# Altium schematic sheet Transmitter.SchDoc: Transmitter
size A4; Organization: HCM Univercity Technology; Address1: 268 Li Thuong Kiet Street; Address2: District 10; Address3: Ho Chi Minh City; Address4: Viet Nam; DocumentNumber: 1.0; Revision: v1.1; SheetNumber: 1; SheetTotal: 1
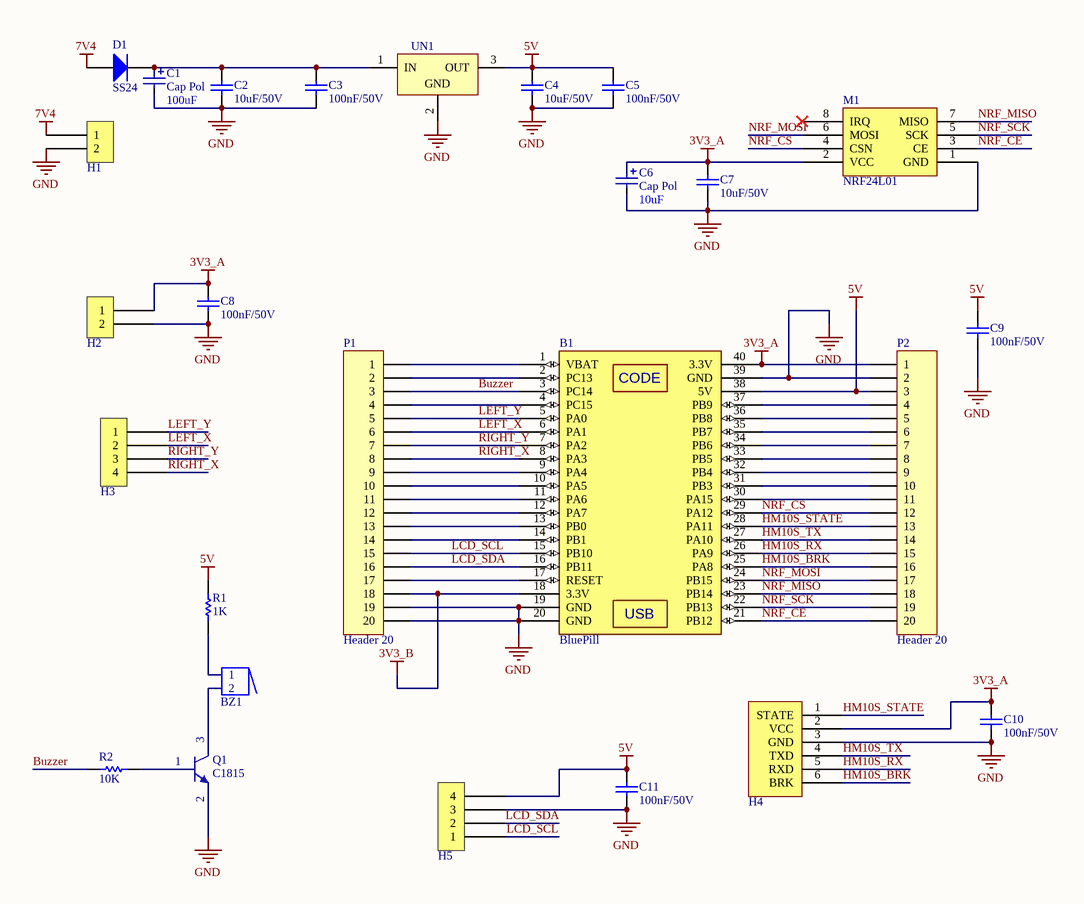
[diagram p0: Transmitter.SchDoc]

## Parts
B1  BluePill  [BlUEPILL]
BZ1  Buzzer  [BUZZER]  (value not drawn)
C1  Cap Pol  value 100uF  [CP1/2]
C2  value 10uF/50V  [CAP-SM-0805]  (hidden comment: Cap-10uF-50V-0805)
C3  value 100nF/50V  [CAP-SM-0805]  (hidden comment: Cap-100nF-50V-0805)
C4  value 10uF/50V  [CAP-SM-0805]  (hidden comment: Cap-10uF-50V-0805)
C5  value 100nF/50V  [CAP-SM-0805]  (hidden comment: Cap-100nF-50V-0805)
C6  Cap Pol  value 10uF  [CP1/2]
C7  value 10uF/50V  [CAP-SM-0805]  (hidden comment: Cap-10uF-50V-0805)
C8  value 100nF/50V  [CAP-SM-0805]  (hidden comment: Cap-100nF-50V-0805)
C9  value 100nF/50V  [CAP-SM-0805]  (hidden comment: Cap-100nF-50V-0805)
C10  value 100nF/50V  [CAP-SM-0805]  (hidden comment: Cap-100nF-50V-0805)
C11  value 100nF/50V  [CAP-SM-0805]  (hidden comment: Cap-100nF-50V-0805)
D1  SS24  [SS24]
H1  XH B2B  [XH B2B]  (value not drawn)
H2  XH B2B  [XH B2B]  (value not drawn)
H3  XHB4B  [XHB4B]  (value not drawn)
H4  HC-05-06-TH  [HM-10S CC2541]  (value not drawn)
H5  XHB4B  [XHB4B]  (value not drawn)
M1  NRF24L01  [NRF24L01]
P1  Header 20  [HDR1X20]
P2  Header 20  [HDR1X20]
Q1  C1815  [QTO-92]
R1  value 1K  [RES-SM-0805]  (hidden comment: Res-1K-0805)
R2  value 10K  [RES-SM-0805]  (hidden comment: Res-10k-0805)
UN1  LM7805  [QTO-220]  (value not drawn)

## Nets
3V3_A: B1.40(3.3V) C6.1 C7.2 C8.2 C10.1 H2.1 H4.2(VCC) M1.2(VCC) P2.1
3V3_B: B1.18(3.3V) P1.18
5V: B1.38(5V) C4.2 C5.2 C9.1 C11.2 H5.4 P2.3 R1.2 UN1.3(OUT)
7V4: D1.2(A) H1.1
GND: B1.19(GND) B1.20(GND) B1.39(GND) C1.2 C2.1 C3.1 C4.1 C5.1 C6.2 C7.1 C8.1 C9.2 C10.2 C11.1 H1.2 H2.2 H4.3(GND) H5.3 M1.1(GND) P1.19 P1.20 P2.2 Q1.2(E) UN1.2(GND)
Buzzer: B1.3(PC14) P1.3 R2.1
HM10S_BRK: B1.25(PA8) H4.6(BRK) P2.16
HM10S_RX: B1.26(PA9) H4.5(RXD) P2.15
HM10S_STATE: B1.28(PA11) H4.1(STATE) P2.13
HM10S_TX: B1.27(PA10) H4.4(TXD) P2.14
LCD_SCL: B1.15(PB10) H5.1 P1.15
LCD_SDA: B1.16(PB11) H5.2 P1.16
LEFT_X: B1.6(PA1) H3.2 P1.6
LEFT_Y: B1.5(PA0) H3.1 P1.5
NRF_CE: B1.21(PB12) M1.3(CE) P2.20
NRF_CS: B1.29(PA12) M1.4(CSN) P2.12
NRF_MISO: B1.23(PB14) M1.7(MISO) P2.18
NRF_MOSI: B1.24(PB15) M1.6(MOSI) P2.17
NRF_SCK: B1.22(PB13) M1.5(SCK) P2.19
RIGHT_X: B1.8(PA3) H3.4 P1.8
RIGHT_Y: B1.7(PA2) H3.3 P1.7
NetB1_1: B1.1(VBAT) P1.1
NetB1_2: B1.2(PC13) P1.2
NetB1_4: B1.4(PC15) P1.4
NetB1_9: B1.9(PA4) P1.9
NetB1_10: B1.10(PA5) P1.10
NetB1_11: B1.11(PA6) P1.11
NetB1_12: B1.12(PA7) P1.12
NetB1_13: B1.13(PB0) P1.13
NetB1_14: B1.14(PB1) P1.14
NetB1_17: B1.17(RESET) P1.17
NetB1_30: B1.30(PA15) P2.11
NetB1_31: B1.31(PB3) P2.10
NetB1_32: B1.32(PB4) P2.9
NetB1_33: B1.33(PB5) P2.8
NetB1_34: B1.34(PB6) P2.7
NetB1_35: B1.35(PB7) P2.6
NetB1_36: B1.36(PB8) P2.5
NetB1_37: B1.37(PB9) P2.4
NetBZ1_1: BZ1.1 R1.1
NetBZ1_2: BZ1.2 Q1.3(C)
NetC1_1: C1.1 C2.2 C3.2 D1.1(K) UN1.1(IN)
NetQ1_1: Q1.1(B) R2.2

Not connected (* = marked no-connect by the designer): M1 8(IRQ)*

## Notes on the sheet
- Title
- Size:
- Date:
- A4
- Number:
- Time:
- Revision:
- Sheet
- of
- File:
- (in symbol BluePill) CODE; USB

## Library data of the parts
C1 C6 = Cap-TH-Pol: Polarized Capacitor (Radial)
C2 C4 C7 = Cap-10uF-50V-0805: CAP CER 10UF 50V X5R 0805; Manufacturer: Yageo; Manufacturer Part Number: CC0805KKX5R9BB106; Local Supplier: thegioiic; Local Supplier Link: https://thegioiic.com/products/tu-10uf-50v-0805; Supplier 1: Digikey; Supplier 1 Link: https://www.digikey.com/product-detail/en/yageo/CC0805KKX5R9BB106/311-3499-2-ND/7164383; Supplier 1 Part Number: 311-3499-2-ND
C3 C5 C8-C11 = Cap-100nF-50V-0805: CAP CER 0.1UF 50V Y5V 0805; Manufacturer: Samsung Electro-Mechanics; Manufacturer Part Number: CL21F104ZBCNNNC; Local Supplier: thegioiic; Local Supplier Link: https://thegioiic.com/products/tu-100nf-0-1uf-50v-0805; Supplier 1: Digikey; Supplier 1 Part Number: 1276-1007-1-ND; Supplier 1 Link: https://www.digikey.com/product-detail/en/samsung-electro-mechanics/CL21F104ZBCNNNC/1276-1007-1-ND/3889093
D1 = Diode-SS24: DIODE SCHOTTKY 40V 2A DO214AA; Manufacturer: ON Semiconductor; Local Supplier: thegioiic; Local Supplier Link: https://thegioiic.com/products/ss24-smb; Supplier 1: Digikey; Supplier 1 Part Number: SS24FSCT-ND; Manufacturer Part Number: SS24; Supplier 1 Link: https://www.digikey.com/product-detail/en/on-semiconductor/SS24/SS24FSCT-ND/1626273
H3 H5 = XH B4B
H4 = HM-10S CC2541: Local Supplier: HShop; Local Supplier Link: https://hshop.vn/products/mach-thu-phat-bluetooth-hc-06-do-ra-chon-slave; Local Supplier Part Number: HS000882; Manufacturer: *; Manufacturer Part Number: *
P1 P2 = Header 20: Header, 20-Pin; LatestRevisionDate: 17-Jul-2002; LatestRevisionNote: Re-released for DXP Platform.; Publisher: Altium Limited
R1 = Res-1K-0805: RES 1K OHM 1% 1/4W 0805; Manufacturer: Stackpole Electronics Inc; Manufacturer Part Number: RNCP0805FTD1K00; Local Supplier: thegioiic; Local Supplier Link: https://thegioiic.com/products/dien-tro-1k-ohm-0805-5; Supplier 1: Digikey; Supplier 1 Link: https://www.digikey.com/product-detail/en/stackpole-electronics-inc/RNCP0805FTD1K00/RNCP0805FTD1K00CT-ND/2240568; Supplier 1 Part Number: RNCP0805FTD1K00CT-ND
R2 = Res-10k-0805: RES 10K OHM 1% 1/4W 0805; Manufacturer: Stackpole Electronics Inc; Manufacturer Part Number: RNCP0805FTD10K0; Local Supplier: thegioiic; Local Supplier Link: https://thegioiic.com/products/dien-tro-10k-ohm-0805-5; Supplier 1: Digikey; Supplier 1 Link: https://www.digikey.com/product-detail/en/stackpole-electronics-inc/RNCP0805FTD10K0/RNCP0805FTD10K0CT-ND/2240601; Supplier 1 Part Number: RNCP0805FTD10K0CT-ND
UN1 = LM7805: Positive Voltage Regulator
M1 = NRF24L01: Local Supplier: HShop; Local Supplier Link: https://hshop.vn/products/mach-thu-phat-rf-nrf24l01-pa-lna-nrf-e04; Local Supplier Part Number: HS000888; Manufacturer: *; Manufacturer Part Number: *